# Altium project RFIDKeypad.PrjPcb
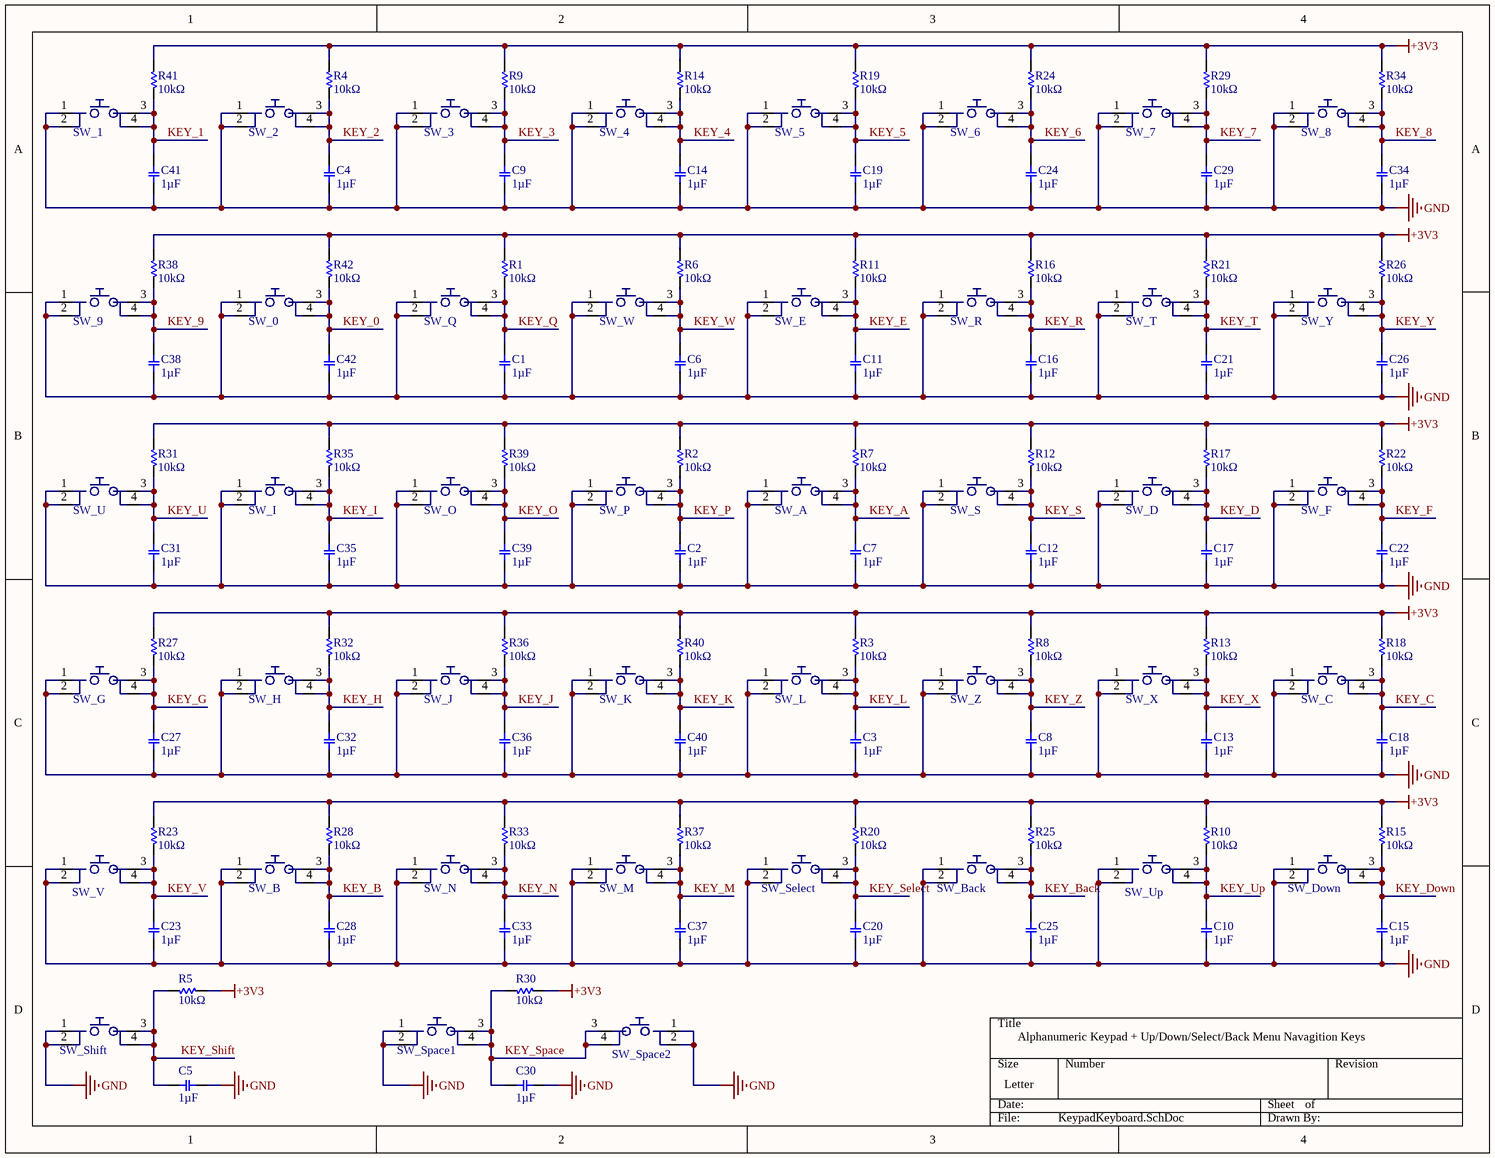
[diagram p0: KeypadKeyboard.SchDoc]
2 sheets, 148 parts. Net scope: global (net labels, ports and power ports of the same name join across sheets).
Board file: KeypadPCB.PcbDoc
Sheets:
  KeypadKeyboard.SchDoc
  KeypadDisplayConnectors.SchDoc

## Sheet KeypadKeyboard.SchDoc
size Letter

### Parts
C1  1µF  [C0805(2012)_NP_med]
C2  1µF  [C0805(2012)_NP_med]
C3  1µF  [C0805(2012)_NP_med]
C4  1µF  [C0805(2012)_NP_med]
C5  1µF  [C0805(2012)_NP_med]
C6  1µF  [C0805(2012)_NP_med]
C7  1µF  [C0805(2012)_NP_med]
C8  1µF  [C0805(2012)_NP_med]
C9  1µF  [C0805(2012)_NP_med]
C10  1µF  [C0805(2012)_NP_med]
C11  1µF  [C0805(2012)_NP_med]
C12  1µF  [C0805(2012)_NP_med]
C13  1µF  [C0805(2012)_NP_med]
C14  1µF  [C0805(2012)_NP_med]
C15  1µF  [C0805(2012)_NP_med]
C16  1µF  [C0805(2012)_NP_med]
C17  1µF  [C0805(2012)_NP_med]
C18  1µF  [C0805(2012)_NP_med]
C19  1µF  [C0805(2012)_NP_med]
C20  1µF  [C0805(2012)_NP_med]
C21  1µF  [C0805(2012)_NP_med]
C22  1µF  [C0805(2012)_NP_med]
C23  1µF  [C0805(2012)_NP_med]
C24  1µF  [C0805(2012)_NP_med]
C25  1µF  [C0805(2012)_NP_med]
C26  1µF  [C0805(2012)_NP_med]
C27  1µF  [C0805(2012)_NP_med]
C28  1µF  [C0805(2012)_NP_med]
C29  1µF  [C0805(2012)_NP_med]
C30  1µF  [C0805(2012)_NP_med]
C31  1µF  [C0805(2012)_NP_med]
C32  1µF  [C0805(2012)_NP_med]
C33  1µF  [C0805(2012)_NP_med]
C34  1µF  [C0805(2012)_NP_med]
C35  1µF  [C0805(2012)_NP_med]
C36  1µF  [C0805(2012)_NP_med]
C37  1µF  [C0805(2012)_NP_med]
C38  1µF  [C0805(2012)_NP_med]
C39  1µF  [C0805(2012)_NP_med]
C40  1µF  [C0805(2012)_NP_med]
C41  1µF  [C0805(2012)_NP_med]
C42  1µF  [C0805(2012)_NP_med]
R1  10kΩ  [R0805(2012)_med]
R2  10kΩ  [R0805(2012)_med]
R3  10kΩ  [R0805(2012)_med]
R4  10kΩ  [R0805(2012)_med]
R5  10kΩ  [R0805(2012)_med]
R6  10kΩ  [R0805(2012)_med]
R7  10kΩ  [R0805(2012)_med]
R8  10kΩ  [R0805(2012)_med]
R9  10kΩ  [R0805(2012)_med]
R10  10kΩ  [R0805(2012)_med]
R11  10kΩ  [R0805(2012)_med]
R12  10kΩ  [R0805(2012)_med]
R13  10kΩ  [R0805(2012)_med]
R14  10kΩ  [R0805(2012)_med]
R15  10kΩ  [R0805(2012)_med]
R16  10kΩ  [R0805(2012)_med]
R17  10kΩ  [R0805(2012)_med]
R18  10kΩ  [R0805(2012)_med]
R19  10kΩ  [R0805(2012)_med]
R20  10kΩ  [R0805(2012)_med]
R21  10kΩ  [R0805(2012)_med]
R22  10kΩ  [R0805(2012)_med]
R23  10kΩ  [R0805(2012)_med]
R24  10kΩ  [R0805(2012)_med]
R25  10kΩ  [R0805(2012)_med]
R26  10kΩ  [R0805(2012)_med]
R27  10kΩ  [R0805(2012)_med]
R28  10kΩ  [R0805(2012)_med]
R29  10kΩ  [R0805(2012)_med]
R30  10kΩ  [R0805(2012)_med]
R31  10kΩ  [R0805(2012)_med]
R32  10kΩ  [R0805(2012)_med]
R33  10kΩ  [R0805(2012)_med]
R34  10kΩ  [R0805(2012)_med]
R35  10kΩ  [R0805(2012)_med]
R36  10kΩ  [R0805(2012)_med]
R37  10kΩ  [R0805(2012)_med]
R38  10kΩ  [R0805(2012)_med]
R39  10kΩ  [R0805(2012)_med]
R40  10kΩ  [R0805(2012)_med]
R41  10kΩ  [R0805(2012)_med]
R42  10kΩ  [R0805(2012)_med]
SW_0  TE 1825910-6  [TE 1825910-6]  (value not drawn)
SW_1  1825910-6  [TE 1825910-6]  (value not drawn)
SW_2  1825910-6  [TE 1825910-6]  (value not drawn)
SW_3  1825910-6  [TE 1825910-6]  (value not drawn)
SW_4  1825910-6  [TE 1825910-6]  (value not drawn)
SW_5  1825910-6  [TE 1825910-6]  (value not drawn)
SW_6  1825910-6  [TE 1825910-6]  (value not drawn)
SW_7  1825910-6  [TE 1825910-6]  (value not drawn)
SW_8  1825910-6  [TE 1825910-6]  (value not drawn)
SW_9  1825910-6  [TE 1825910-6]  (value not drawn)
SW_A  1825910-6  [TE 1825910-6]  (value not drawn)
SW_B  1825910-6  [TE 1825910-6]  (value not drawn)
SW_Back  1825910-6  [TE 1825910-6]  (value not drawn)
SW_C  1825910-6  [TE 1825910-6]  (value not drawn)
SW_D  1825910-6  [TE 1825910-6]  (value not drawn)
SW_Down  1825910-6  [TE 1825910-6]  (value not drawn)
SW_E  1825910-6  [TE 1825910-6]  (value not drawn)
SW_F  1825910-6  [TE 1825910-6]  (value not drawn)
SW_G  1825910-6  [TE 1825910-6]  (value not drawn)
SW_H  1825910-6  [TE 1825910-6]  (value not drawn)
SW_I  1825910-6  [TE 1825910-6]  (value not drawn)
SW_J  1825910-6  [TE 1825910-6]  (value not drawn)
SW_K  1825910-6  [TE 1825910-6]  (value not drawn)
SW_L  1825910-6  [TE 1825910-6]  (value not drawn)
SW_M  1825910-6  [TE 1825910-6]  (value not drawn)
SW_N  1825910-6  [TE 1825910-6]  (value not drawn)
SW_O  1825910-6  [TE 1825910-6]  (value not drawn)
SW_P  1825910-6  [TE 1825910-6]  (value not drawn)
SW_Q  1825910-6  [TE 1825910-6]  (value not drawn)
SW_R  1825910-6  [TE 1825910-6]  (value not drawn)
SW_S  1825910-6  [TE 1825910-6]  (value not drawn)
SW_Select  1825910-6  [TE 1825910-6]  (value not drawn)
SW_Shift  1825910-6  [TE 1825910-6]  (value not drawn)
SW_Space1  1825910-6  [TE 1825910-6]  (value not drawn)
SW_Space2  1825910-6  [TE 1825910-6]  (value not drawn)
SW_T  1825910-6  [TE 1825910-6]  (value not drawn)
SW_U  1825910-6  [TE 1825910-6]  (value not drawn)
SW_Up  1825910-6  [TE 1825910-6]  (value not drawn)
SW_V  1825910-6  [TE 1825910-6]  (value not drawn)
SW_W  1825910-6  [TE 1825910-6]  (value not drawn)
SW_X  1825910-6  [TE 1825910-6]  (value not drawn)
SW_Y  1825910-6  [TE 1825910-6]  (value not drawn)
SW_Z  1825910-6  [TE 1825910-6]  (value not drawn)

### Nets
+3V3: R1.1 R2.1 R3.1 R4.1 R5.2 R6.1 R7.1 R8.1 R9.1 R10.1 R11.1 R12.1 R13.1 R14.1 R15.1 R16.1 R17.1 R18.1 R19.1 R20.1 R21.1 R22.1 R23.1 R24.1 R25.1 R26.1 R27.1 R28.1 R29.1 R30.1 R31.1 R32.1 R33.1 R34.1 R35.1 R36.1 R37.1 R38.1 R39.1 R40.1 R41.1 R42.1
GND: C1.1 C2.1 C3.1 C4.1 C5.2 C6.1 C7.1 C8.1 C9.1 C10.1 C11.1 C12.1 C13.1 C14.1 C15.1 C16.1 C17.1 C18.1 C19.1 C20.1 C21.1 C22.1 C23.1 C24.1 C25.1 C26.1 C27.1 C28.1 C29.1 C30.2 C31.1 C32.1 C33.1 C34.1 C35.1 C36.1 C37.1 C38.1 C39.1 C40.1 C41.1 C42.1 SW_0.1 SW_0.2 SW_1.1 SW_1.2 SW_2.1 SW_2.2 SW_3.1 SW_3.2 SW_4.1 SW_4.2 SW_5.1 SW_5.2 SW_6.1 SW_6.2 SW_7.1 SW_7.2 SW_8.1 SW_8.2 SW_9.1 SW_9.2 SW_A.1 SW_A.2 SW_B.1 SW_B.2 SW_Back.1 SW_Back.2 SW_C.1 SW_C.2 SW_D.1 SW_D.2 SW_Down.1 SW_Down.2 SW_E.1 SW_E.2 SW_F.1 SW_F.2 SW_G.1 SW_G.2 SW_H.1 SW_H.2 SW_I.1 SW_I.2 SW_J.1 SW_J.2 SW_K.1 SW_K.2 SW_L.1 SW_L.2 SW_M.1 SW_M.2 SW_N.1 SW_N.2 SW_O.1 SW_O.2 SW_P.1 SW_P.2 SW_Q.1 SW_Q.2 SW_R.1 SW_R.2 SW_S.1 SW_S.2 SW_Select.1 SW_Select.2 SW_Shift.1 SW_Shift.2 SW_Space1.1 SW_Space1.2 SW_Space2.1 SW_Space2.2 SW_T.1 SW_T.2 SW_U.1 SW_U.2 SW_Up.1 SW_Up.2 SW_V.1 SW_V.2 SW_W.1 SW_W.2 SW_X.1 SW_X.2 SW_Y.1 SW_Y.2 SW_Z.1 SW_Z.2
KEY_0: C42.2 R42.2 SW_0.3 SW_0.4
KEY_1: C41.2 R41.2 SW_1.3 SW_1.4
KEY_2: C4.2 R4.2 SW_2.3 SW_2.4
KEY_3: C9.2 R9.2 SW_3.3 SW_3.4
KEY_4: C14.2 R14.2 SW_4.3 SW_4.4
KEY_5: C19.2 R19.2 SW_5.3 SW_5.4
KEY_6: C24.2 R24.2 SW_6.3 SW_6.4
KEY_7: C29.2 R29.2 SW_7.3 SW_7.4
KEY_8: C34.2 R34.2 SW_8.3 SW_8.4
KEY_9: C38.2 R38.2 SW_9.3 SW_9.4
KEY_A: C7.2 R7.2 SW_A.3 SW_A.4
KEY_B: C28.2 R28.2 SW_B.3 SW_B.4
KEY_Back: C25.2 R25.2 SW_Back.3 SW_Back.4
KEY_C: C18.2 R18.2 SW_C.3 SW_C.4
KEY_D: C17.2 R17.2 SW_D.3 SW_D.4
KEY_Down: C15.2 R15.2 SW_Down.3 SW_Down.4
KEY_E: C11.2 R11.2 SW_E.3 SW_E.4
KEY_F: C22.2 R22.2 SW_F.3 SW_F.4
KEY_G: C27.2 R27.2 SW_G.3 SW_G.4
KEY_H: C32.2 R32.2 SW_H.3 SW_H.4
KEY_I: C35.2 R35.2 SW_I.3 SW_I.4
KEY_J: C36.2 R36.2 SW_J.3 SW_J.4
KEY_K: C40.2 R40.2 SW_K.3 SW_K.4
KEY_L: C3.2 R3.2 SW_L.3 SW_L.4
KEY_M: C37.2 R37.2 SW_M.3 SW_M.4
KEY_N: C33.2 R33.2 SW_N.3 SW_N.4
KEY_O: C39.2 R39.2 SW_O.3 SW_O.4
KEY_P: C2.2 R2.2 SW_P.3 SW_P.4
KEY_Q: C1.2 R1.2 SW_Q.3 SW_Q.4
KEY_R: C16.2 R16.2 SW_R.3 SW_R.4
KEY_S: C12.2 R12.2 SW_S.3 SW_S.4
KEY_Select: C20.2 R20.2 SW_Select.3 SW_Select.4
KEY_Shift: C5.1 R5.1 SW_Shift.3 SW_Shift.4
KEY_Space: C30.1 R30.2 SW_Space1.3 SW_Space1.4 SW_Space2.3 SW_Space2.4
KEY_T: C21.2 R21.2 SW_T.3 SW_T.4
KEY_U: C31.2 R31.2 SW_U.3 SW_U.4
KEY_Up: C10.2 R10.2 SW_Up.3 SW_Up.4
KEY_V: C23.2 R23.2 SW_V.3 SW_V.4
KEY_W: C6.2 R6.2 SW_W.3 SW_W.4
KEY_X: C13.2 R13.2 SW_X.3 SW_X.4
KEY_Y: C26.2 R26.2 SW_Y.3 SW_Y.4
KEY_Z: C8.2 R8.2 SW_Z.3 SW_Z.4

### Notes on the sheet
- Alphanumeric Keypad + Up/Down/Select/Back Menu Navagition Keys

### Library data of the parts
C1-C42 = CPN_SMT: SMT Capacitor; Tolerance: X7R; Rating: 16v; Value: 1µF
R1-R42 = RES_SMT: SMT resistor; Tolerance: 1%; Value: 10kΩ
SW_0 = TE 1825910-6: SWITCH TACTILE SPST-NO 0.05A 24V; Manufacturer: TE Connectivity Alcoswitch Switches; Switch Function: Off-Mom; Contact Rating @ Voltage: 0.05A @ 24VDC; Actuator Type: Standard; Actuator Height off PCB, from Pins: 5.00mm; Actuator Orientation: Top Actuated; Outline: 6.00mm x 6.00mm; Illumination: Non-Illuminated; Operating Force: 160gf; Actuator Material: Polybutylene Terephthalate (PBT); Switch Travel: 0.25mm; Mechanical Life: 100,000 Cycles; Supplier 1: Digi-Key; Manufacturer Part Number: 1825910-6; RoHS: RoHS Compliant; Category: Switches; Stock 1: 68158; Pricing 1: 1=0.11, 25=0.1012, 50=0.0912, 100=0.0869, 250=0.08028, 500=0.07698, 1000=0.06268, 2000=0.05609, 5000=0.05278 (USD); Packaging: Bulk; Circuit: SPST-NO; Mounting Type: Through Hole; Termination Style: PC Pin; Illumination Voltage (Nominal): -; Illumination Type, Color: -; Ingress Protection: -; Features: -; Operating Temperature: -35°C ~ 85°C; ComponentLink1URL: http://www.te.com/commerce/DocumentDelivery/DDEController?Action=srchrtrv&DocNm=1825910&DocType=Customer+Drawing&DocLang=English; ComponentLink1Description: http://www.te.com/commerce/DocumentDelivery/DDEController?Action=srchrtrv&DocNm=1825910&DocType=Customer+Drawing&DocLang=English
SW_1-SW_9 SW_A SW_B SW_Back SW_C SW_D SW_Down SW_E SW_F SW_G SW_H SW_I SW_J SW_K SW_L SW_M SW_N SW_O SW_P SW_Q SW_R SW_S SW_Select SW_Shift SW_Space1 SW_Space2 SW_T SW_U SW_Up SW_V SW_W SW_X SW_Y SW_Z = 1825910-6: SWITCH TACTILE SPST-NO 0.05A 24V; Manufacturer: TE Connectivity Alcoswitch Switches; Switch Function: Off-Mom; Contact Rating @ Voltage: 0.05A @ 24VDC; Actuator Type: Standard; Actuator Height off PCB, from Pins: 5.00mm; Actuator Orientation: Top Actuated; Outline: 6.00mm x 6.00mm; Illumination: Non-Illuminated; Operating Force: 160gf; Actuator Material: Polybutylene Terephthalate (PBT); Switch Travel: 0.25mm; Mechanical Life: 100,000 Cycles; Supplier 1: Digi-Key; Manufacturer Part Number: 1825910-6; RoHS: RoHS Compliant; Category: Switches; Stock 1: 68158; Pricing 1: 1=0.11, 25=0.1012, 50=0.0912, 100=0.0869, 250=0.08028, 500=0.07698, 1000=0.06268, 2000=0.05609, 5000=0.05278 (USD); Packaging: Bulk; Circuit: SPST-NO; Mounting Type: Through Hole; Termination Style: PC Pin; Illumination Voltage (Nominal): -; Illumination Type, Color: -; Ingress Protection: -; Features: -; Operating Temperature: -35°C ~ 85°C; ComponentLink1URL: http://www.te.com/commerce/DocumentDelivery/DDEController?Action=srchrtrv&DocNm=1825910&DocType=Customer+Drawing&DocLang=English; ComponentLink1Description: http://www.te.com/commerce/DocumentDelivery/DDEController?Action=srchrtrv&DocNm=1825910&DocType=Customer+Drawing&DocLang=English

## Sheet KeypadDisplayConnectors.SchDoc
size Letter
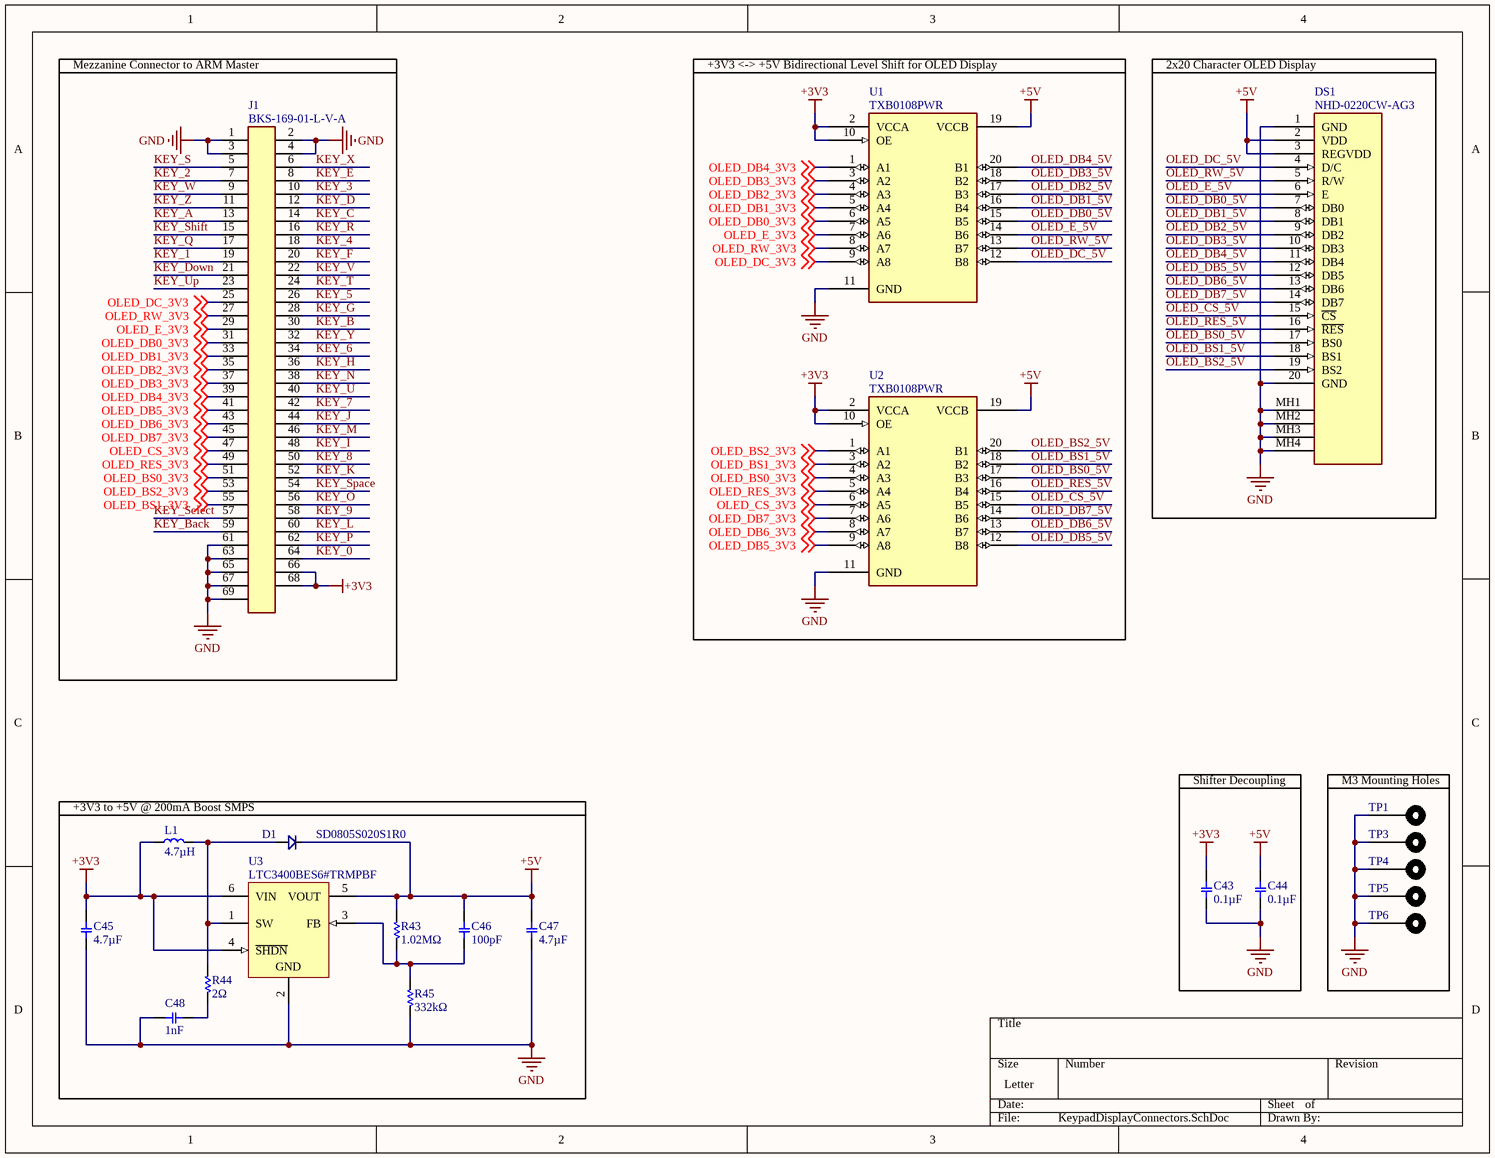
[diagram p1: KeypadDisplayConnectors.SchDoc]

### Parts
C43  0.1µF  [C0805(2012)_NP_med]
C44  0.1µF  [C0805(2012)_NP_med]
C45  4.7µF  [C0805(2012)_NP_med]
C46  100pF  [C0805(2012)_NP_med]
C47  4.7µF  [C0805(2012)_NP_med]
C48  1nF  [C0805(2012)_NP_med]
D1  SD0805S020S1R0  [C0805(2012)_P_med]
DS1  NHD-0220CW-AG3  [Newhaven NHD-0220CW-AG3]
J1  BKS-169-01-L-V-A  [SAMTEC BKS-169-01-L-V-A]
L1  4.7µH  [C0805(2012)_NP_med]
R43  1.02MΩ  [R0805(2012)_med]
R44  2Ω  [R0805(2012)_med]
R45  332kΩ  [R0805(2012)_med]
TP1  Testpoint  [M3x0.5 Hole]  (value not drawn)
TP3  Testpoint  [M3x0.5 Hole]  (value not drawn)
TP4  Testpoint  [M3x0.5 Hole]  (value not drawn)
TP5  Testpoint  [M3x0.5 Hole]  (value not drawn)
TP6  Testpoint  [M3x0.5 Hole]  (value not drawn)
U1  TXB0108PWR  [TI 20 Pin PW (R-PDSO-G20)]
U2  TXB0108PWR  [TI 20 Pin PW (R-PDSO-G20)]
U3  LTC3400BES6#TRMPBF  [LT-S6-6-TSOT-23_N]

### Blocks framed on the sheet
+3V3 <-> +5V Bidirectional Level Shift for OLED Display: U1 U2
2x20 Character OLED Display: DS1
Shifter Decoupling: C43 C44
M3 Mounting Holes: TP1 TP3-TP6
+3V3 to +5V @ 200mA Boost SMPS: C45-C48 D1 L1 R43-R45 U3

### Nets
+3V3: C43.1 C45.1 J1.66 J1.68 L1.1 U1.2(VCCA) U1.10(OE) U2.2(VCCA) U2.10(OE) U3.4(~{SHDN}) U3.6(VIN)
+5V: C44.1 C46.1 C47.1 D1.1(K) DS1.2(VDD) DS1.3(REGVDD) R43.1 U1.19(VCCB) U2.19(VCCB) U3.5(VOUT)
GND: C43.2 C44.2 C45.2 C47.2 C48.1 DS1.1(GND) DS1.20(GND) DS1.MH1 DS1.MH2 DS1.MH3 DS1.MH4 J1.1 J1.2 J1.3 J1.4 J1.61 J1.63 J1.65 J1.67 J1.69 R45.2 TP1.1 TP3.1 TP4.1 TP5.1 TP6.1 U1.11(GND) U2.11(GND) U3.2(GND)
KEY_0: J1.64
KEY_1: J1.19
KEY_2: J1.7
KEY_3: J1.10
KEY_4: J1.18
KEY_5: J1.26
KEY_6: J1.34
KEY_7: J1.42
KEY_8: J1.50
KEY_9: J1.58
KEY_A: J1.13
KEY_B: J1.30
KEY_Back: J1.59
KEY_C: J1.14
KEY_D: J1.12
KEY_Down: J1.21
KEY_E: J1.8
KEY_F: J1.20
KEY_G: J1.28
KEY_H: J1.36
KEY_I: J1.48
KEY_J: J1.44
KEY_K: J1.52
KEY_L: J1.60
KEY_M: J1.46
KEY_N: J1.38
KEY_O: J1.56
KEY_P: J1.62
KEY_Q: J1.17
KEY_R: J1.16
KEY_S: J1.5
KEY_Select: J1.57
KEY_Shift: J1.15
KEY_Space: J1.54
KEY_T: J1.24
KEY_U: J1.40
KEY_Up: J1.23
KEY_V: J1.22
KEY_W: J1.9
KEY_X: J1.6
KEY_Y: J1.32
KEY_Z: J1.11
OLED_BS0_3V3: J1.51 U2.4(A3) ; off-sheet OLED_BS0_3V3
OLED_BS0_5V: DS1.17(BS0) U2.17(B3)
OLED_BS1_3V3: J1.55 U2.3(A2) ; off-sheet OLED_BS1_3V3
OLED_BS1_5V: DS1.18(BS1) U2.18(B2)
OLED_BS2_3V3: J1.53 U2.1(A1) ; off-sheet OLED_BS2_3V3
OLED_BS2_5V: DS1.19(BS2) U2.20(B1)
OLED_CS_3V3: J1.47 U2.6(A5) ; off-sheet OLED_CS_3V3
OLED_CS_5V: DS1.15(~{CS}) U2.15(B5)
OLED_DB0_3V3: J1.31 U1.6(A5) ; off-sheet OLED_DB0_3V3
OLED_DB0_5V: DS1.7(DB0) U1.15(B5)
OLED_DB1_3V3: J1.33 U1.5(A4) ; off-sheet OLED_DB1_3V3
OLED_DB1_5V: DS1.8(DB1) U1.16(B4)
OLED_DB2_3V3: J1.35 U1.4(A3) ; off-sheet OLED_DB2_3V3
OLED_DB2_5V: DS1.9(DB2) U1.17(B3)
OLED_DB3_3V3: J1.37 U1.3(A2) ; off-sheet OLED_DB3_3V3
OLED_DB3_5V: DS1.10(DB3) U1.18(B2)
OLED_DB4_3V3: J1.39 U1.1(A1) ; off-sheet OLED_DB4_3V3
OLED_DB4_5V: DS1.11(DB4) U1.20(B1)
OLED_DB5_3V3: J1.41 U2.9(A8) ; off-sheet OLED_DB5_3V3
OLED_DB5_5V: DS1.12(DB5) U2.12(B8)
OLED_DB6_3V3: J1.43 U2.8(A7) ; off-sheet OLED_DB6_3V3
OLED_DB6_5V: DS1.13(DB6) U2.13(B7)
OLED_DB7_3V3: J1.45 U2.7(A6) ; off-sheet OLED_DB7_3V3
OLED_DB7_5V: DS1.14(DB7) U2.14(B6)
OLED_DC_3V3: J1.25 U1.9(A8) ; off-sheet OLED_DC_3V3
OLED_DC_5V: DS1.4(D/C) U1.12(B8)
OLED_E_3V3: J1.29 U1.7(A6) ; off-sheet OLED_E_3V3
OLED_E_5V: DS1.6(E) U1.14(B6)
OLED_RES_3V3: J1.49 U2.5(A4) ; off-sheet OLED_RES_3V3
OLED_RES_5V: DS1.16(~{RES}) U2.16(B4)
OLED_RW_3V3: J1.27 U1.8(A7) ; off-sheet OLED_RW_3V3
OLED_RW_5V: DS1.5(R/W) U1.13(B7)
NetC46_2: C46.2 R43.2 R45.1 U3.3(FB)
NetC48_2: C48.2 R44.2
NetD1_2: D1.2(A) L1.2 R44.1 U3.1(SW)

### Notes on the sheet
- Mezzanine Connector to ARM Master

### Library data of the parts
C43 C44 C46 C48 = CPN_SMT: as C1 on sheet KeypadKeyboard
  C43 C44: Value: 0.1µF
  C46: Value: 100pF
  C48: Value: 1nF
C45 C47 = CPN_SMT: SMT Capacitor; Manufacturer: Taiyo Yuden; Part Number: JMK212BJ475MG; Tolerance: X7R; Rating: 16v; Digikey #: 587-2717-1-ND; Value: 4.7µF
D1 = DIODE_sMT: SMT LED; Manufacturer: AVX; Part Number: SD0805S020S1R0; Digikey #: 478-7800-1-ND
DS1 = NewHaven NHD-0220CW-AG3: Slim Character OLED. 2 lines x 20 character Green OLED display. 2.8V or 5V power. 4/8-bit Parallel, SPI, or I2C MPU interface. 3 built-in font tables. Double height characters.; Manufacturer: Newhaven Display Intl; Number of Characters: 40; Display Format: 20 x 2; Character Format: 5 x 8 Dots; Display Mode: Passive; Character Size: 5.57mm H x 3.22mm W; Outline L x W x H: 92.00mm x 23.30mm x 2.50mm; Viewing Area: 77.92mm L x 16.28mm W; Voltage - Supply: 2.4 V ~ 5.5 V; Dot Size: 0.62mm W x 0.67mm H; Interface: Parallel, 8-Bit, I²C, SPI; Background Color: Black; Supplier 1: Digi-Key; Manufacturer Part Number: NHD-0220CW-AG3; RoHS: RoHS Compliant; Category: Optoelectronics; Stock 1: 82; Pricing 1: 1=27.5, 5=25.85, 10=24.2, 50=22.83, 100=21.73, 250=20.62996, 500=19.8 (USD); Display Type: OLED; Backlight: -; Operating Temperature: -40°C ~ 85°C; Text Color: Green; ComponentLink1URL: http://www.newhavendisplay.com/specs/NHD-0220CW-AG3.pdf; ComponentLink1Description: http://www.newhavendisplay.com/specs/NHD-0220CW-AG3.pdf; Supplier Part Number 1: NHD-0220CW-AG3-ND
J1 = Samtec BKS-169-01-L-V-A: CONN HDR 69POS 1MM SMD GLD
L1 = IND_SMT: SMT Inductor; Manufacturer: Murata; Part Number: LQM2MPN4R7MG0L; Tolerance: 5%; Rating: 700mA; Digikey #: 490-12073-1-ND; Value: 4.7µH
R43-R45 = RES_SMT: SMT resistor; Tolerance: 1%
  R43: Value: 1.02MΩ
  R44: Value: 2Ω
  R45: Value: 332kΩ
U1 U2 = TI TXB0108PWR: IC 8-BIT TRNSTR 15KV ESD 20TSSOP; Manufacturer: Texas Instruments; Translator Type: Voltage Level; Channel Type: Bidirectional; Number of Circuits: 1; Channels per Circuit: 8; Voltage - VCCA: 1.2 V ~ 3.6 V; Voltage - VCCB: 1.65 V ~ 5.5 V; Output Type: Tri-State, Non-Inverted; Data Rate: 100Mbps; Supplier 1: Digi-Key; Manufacturer Part Number: TXB0108PWR; RoHS: RoHS Compliant; Category: Integrated Circuits (ICs); Stock 1: 25140; Pricing 1: 1=1.88, 10=1.693, 100=1.3578, 500=1.116, 1000=0.775 (USD); Packaging: Cut Tape (CT); Input Signal: -; Output Signal: -; Operating Temperature: -40°C ~ 85°C (TA); Features: Auto-Direction Sensing; Mounting Type: Surface Mount; Package / Case: 20-TSSOP (0.173", 4.40mm Width); Supplier Device Package: 20-TSSOP; ComponentLink1URL: http://www.ti.com/lit/ds/symlink/txb0108.pdf; ComponentLink1Description: http://www.ti.com/lit/ds/symlink/txb0108.pdf
U3 = LTC3400BES6#TRMPBF: 600 mA, 1.2 MHz Micropower Synchronous Boost Converter, 6-pin SOT23 (S6-6), -30 to 85 degC, Pb-Free, Mini Tape and Reel; Manufacturer: Linear Technology; Number of Outputs: 1; DatasheetVersion: Rev. A; PackageVersion: Jun-10; PackageReference: S6-6; PackageDescription: 6-Pin Plastic TSOT-23, Body 2.9 x 1.63 mm, Pitch 0.95 mm; Supplier 1: Digi-Key; Supplier Part Number 1: LTC3400BES6#TRMPBFTR-ND; Supplier 2: Digi-Key; Supplier Part Number 2: LTC3400BES6#TRMPBFCT-ND; Supplier 3: Digi-Key; Supplier Part Number 3: LTC3400BES6#TRMPBFDKR-ND; Supplier 4: Newark; Supplier Part Number 4: 56M7484; Packing: Mini Tape and Reel; RoHS: TRUE; Mounting Technology: Surface Mount; Code_JEDEC: MO-193; PartNumber: LTC3400BES6#TRMPBF; ComponentLink1Description: Manufacturer URL; ComponentLink1URL: http://www.linear.com/; ComponentLink2Description: Datasheet; ComponentLink2URL: http://cds.linear.com/docs/en/datasheet/3400fa.pdf; ComponentLink3Description: Package Specification; ComponentLink3URL: http://cds.linear.com/docs/en/packaging/SOT_6_05-08-1636.pdf

## Nets that join several sheets
+3V3: KeypadKeyboard (42 pins), KeypadDisplayConnectors (11 pins)
GND: KeypadKeyboard (128 pins), KeypadDisplayConnectors (29 pins)
KEY_0: KeypadKeyboard (C42.2 R42.2 SW_0.3 SW_0.4), KeypadDisplayConnectors (J1.64)
KEY_1: KeypadKeyboard (C41.2 R41.2 SW_1.3 SW_1.4), KeypadDisplayConnectors (J1.19)
KEY_2: KeypadKeyboard (C4.2 R4.2 SW_2.3 SW_2.4), KeypadDisplayConnectors (J1.7)
KEY_3: KeypadKeyboard (C9.2 R9.2 SW_3.3 SW_3.4), KeypadDisplayConnectors (J1.10)
KEY_4: KeypadKeyboard (C14.2 R14.2 SW_4.3 SW_4.4), KeypadDisplayConnectors (J1.18)
KEY_5: KeypadKeyboard (C19.2 R19.2 SW_5.3 SW_5.4), KeypadDisplayConnectors (J1.26)
KEY_6: KeypadKeyboard (C24.2 R24.2 SW_6.3 SW_6.4), KeypadDisplayConnectors (J1.34)
KEY_7: KeypadKeyboard (C29.2 R29.2 SW_7.3 SW_7.4), KeypadDisplayConnectors (J1.42)
KEY_8: KeypadKeyboard (C34.2 R34.2 SW_8.3 SW_8.4), KeypadDisplayConnectors (J1.50)
KEY_9: KeypadKeyboard (C38.2 R38.2 SW_9.3 SW_9.4), KeypadDisplayConnectors (J1.58)
KEY_A: KeypadKeyboard (C7.2 R7.2 SW_A.3 SW_A.4), KeypadDisplayConnectors (J1.13)
KEY_B: KeypadKeyboard (C28.2 R28.2 SW_B.3 SW_B.4), KeypadDisplayConnectors (J1.30)
KEY_Back: KeypadKeyboard (C25.2 R25.2 SW_Back.3 SW_Back.4), KeypadDisplayConnectors (J1.59)
KEY_C: KeypadKeyboard (C18.2 R18.2 SW_C.3 SW_C.4), KeypadDisplayConnectors (J1.14)
KEY_D: KeypadKeyboard (C17.2 R17.2 SW_D.3 SW_D.4), KeypadDisplayConnectors (J1.12)
KEY_Down: KeypadKeyboard (C15.2 R15.2 SW_Down.3 SW_Down.4), KeypadDisplayConnectors (J1.21)
KEY_E: KeypadKeyboard (C11.2 R11.2 SW_E.3 SW_E.4), KeypadDisplayConnectors (J1.8)
KEY_F: KeypadKeyboard (C22.2 R22.2 SW_F.3 SW_F.4), KeypadDisplayConnectors (J1.20)
KEY_G: KeypadKeyboard (C27.2 R27.2 SW_G.3 SW_G.4), KeypadDisplayConnectors (J1.28)
KEY_H: KeypadKeyboard (C32.2 R32.2 SW_H.3 SW_H.4), KeypadDisplayConnectors (J1.36)
KEY_I: KeypadKeyboard (C35.2 R35.2 SW_I.3 SW_I.4), KeypadDisplayConnectors (J1.48)
KEY_J: KeypadKeyboard (C36.2 R36.2 SW_J.3 SW_J.4), KeypadDisplayConnectors (J1.44)
KEY_K: KeypadKeyboard (C40.2 R40.2 SW_K.3 SW_K.4), KeypadDisplayConnectors (J1.52)
KEY_L: KeypadKeyboard (C3.2 R3.2 SW_L.3 SW_L.4), KeypadDisplayConnectors (J1.60)
KEY_M: KeypadKeyboard (C37.2 R37.2 SW_M.3 SW_M.4), KeypadDisplayConnectors (J1.46)
KEY_N: KeypadKeyboard (C33.2 R33.2 SW_N.3 SW_N.4), KeypadDisplayConnectors (J1.38)
KEY_O: KeypadKeyboard (C39.2 R39.2 SW_O.3 SW_O.4), KeypadDisplayConnectors (J1.56)
KEY_P: KeypadKeyboard (C2.2 R2.2 SW_P.3 SW_P.4), KeypadDisplayConnectors (J1.62)
KEY_Q: KeypadKeyboard (C1.2 R1.2 SW_Q.3 SW_Q.4), KeypadDisplayConnectors (J1.17)
KEY_R: KeypadKeyboard (C16.2 R16.2 SW_R.3 SW_R.4), KeypadDisplayConnectors (J1.16)
KEY_S: KeypadKeyboard (C12.2 R12.2 SW_S.3 SW_S.4), KeypadDisplayConnectors (J1.5)
KEY_Select: KeypadKeyboard (C20.2 R20.2 SW_Select.3 SW_Select.4), KeypadDisplayConnectors (J1.57)
KEY_Shift: KeypadKeyboard (C5.1 R5.1 SW_Shift.3 SW_Shift.4), KeypadDisplayConnectors (J1.15)
KEY_Space: KeypadKeyboard (6 pins), KeypadDisplayConnectors (J1.54)
KEY_T: KeypadKeyboard (C21.2 R21.2 SW_T.3 SW_T.4), KeypadDisplayConnectors (J1.24)
KEY_U: KeypadKeyboard (C31.2 R31.2 SW_U.3 SW_U.4), KeypadDisplayConnectors (J1.40)
KEY_Up: KeypadKeyboard (C10.2 R10.2 SW_Up.3 SW_Up.4), KeypadDisplayConnectors (J1.23)
KEY_V: KeypadKeyboard (C23.2 R23.2 SW_V.3 SW_V.4), KeypadDisplayConnectors (J1.22)
KEY_W: KeypadKeyboard (C6.2 R6.2 SW_W.3 SW_W.4), KeypadDisplayConnectors (J1.9)
KEY_X: KeypadKeyboard (C13.2 R13.2 SW_X.3 SW_X.4), KeypadDisplayConnectors (J1.6)
KEY_Y: KeypadKeyboard (C26.2 R26.2 SW_Y.3 SW_Y.4), KeypadDisplayConnectors (J1.32)
KEY_Z: KeypadKeyboard (C8.2 R8.2 SW_Z.3 SW_Z.4), KeypadDisplayConnectors (J1.11)